# EAGLE design untitled (EAGLE 9.6.2)
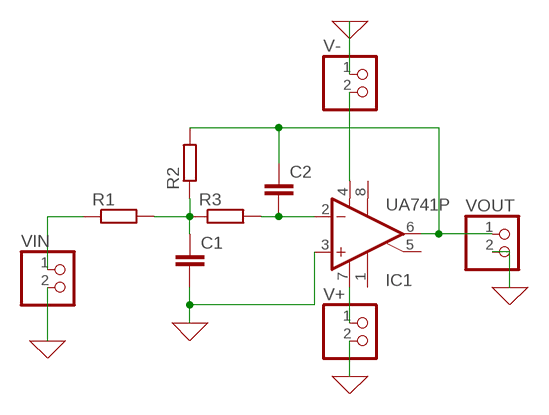
[diagram p0: schematic, sheet 1]

## Parts
C1  C-EU025-025X050  [C025-025X050]
C2  C-EU025-025X050  [C025-025X050]
IC1  UA741P  [DIL08]
R1  R-EU_0411/3V  [0411V]
R2  R-EU_0411/3V  [0411V]
R3  R-EU_0411/3V  [0411V]
V+  PINHD-1X2  [1X02]
V-  PINHD-1X2  [1X02]
VIN  PINHD-1X2  [1X02]
VOUT  PINHD-1X2  [1X02]

## Nets
0: C1.2 IC1.3(+IN) V+.2 V-.1 VIN.2 VOUT.2 ; supply symbol labelled GND
N$1: C1.1 R1.2 R2.1 R3.1
N$2: IC1.7(V+) V+.1
N$3: IC1.4(V-) V-.2
N$4: C2.1 IC1.6(OUT) R2.2 VOUT.1
N$5: C2.2 IC1.2(-IN) R3.2
N$6: R1.1 VIN.1
Unconnected: IC1.1(ON1) IC1.5(ON2) IC1.8(OPT)

## Library data of the parts
C1 C2 = rcl:C-EU: CAPACITOR, European symbol; SPICEPREFIX: C
IC1 = linear:*741: OP AMP
R1-R3 = rcl:R-EU_: RESISTOR, European symbol; SPICEPREFIX: R
V+ V- VIN VOUT = pinhead:PINHD-1X2: PIN HEADER

## Board
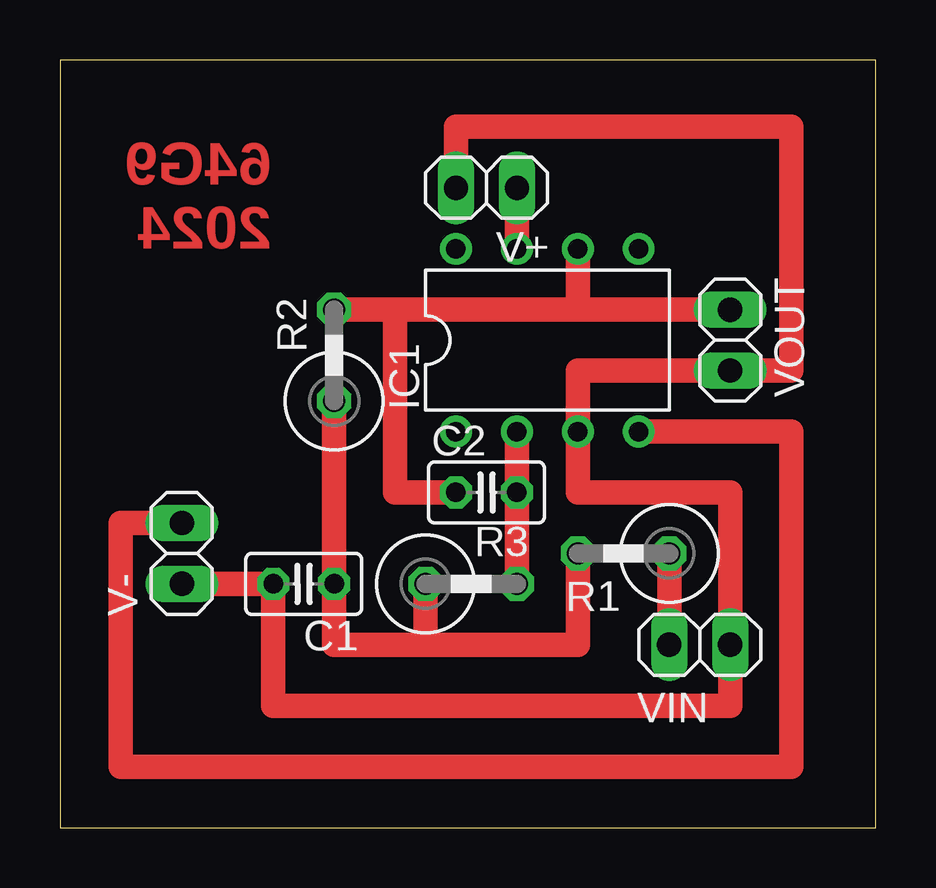
[diagram p1: board, top side]

Size 34 x 32 mm. Coordinates in mm from the lower left corner, seen from the top.
Outline: 0,0 34,0 34,32 0,32 0,0
Copper layers (1*16): Top 0.035mm / dielectric 1.5mm / Bottom 0.035mm
Design rules "default": minimum track width 6mil, minimum drill 0.35mm, track to track 6mil, track to pad 6mil, pad to pad 6mil, via to via 6mil, smd to smd 6mil, copper to edge 40mil, drill to drill 6mil, minimum pad ring 10mil, minimum via ring 8mil, stop-mask expansion 4mil, vias tented up to drill 0mil, thermal gap 10mil

### Footprints (pad centres in the part's own frame; a part is rotated, then mirrored left to right if it is on the bottom)
C025-025X050 = drill 0.813 octagon: 1 -1.27,0; 2 1.27,0
DIL08 = drill 0.813 pad 1.27: 1 -3.81,-3.81; 2 -1.27,-3.81; 3 1.27,-3.81; 4 3.81,-3.81; 5 3.81,3.81; 6 1.27,3.81; 7 -1.27,3.81; 8 -3.81,3.81
0411V = drill 0.914 octagon: 1 -2.54,0; 2 1.27,0
1X02 = drill 1.016 long: 1 -1.27,0; 2 1.27,0

### Placement (x,y rotation side)
C1  10.16,10.16 180 top
C2  17.78,13.97 0 top
IC1  20.32,20.32 0 top
R1  22.86,11.43 180 top
R2  11.43,20.32 90 top
R3  17.78,10.16 0 top
V+  17.78,26.67 180 top
V-  5.08,11.43 90 top
VIN  26.67,7.62 0 top
VOUT  27.94,20.32 270 top

### Tracks (layer width: path | path; a pad name or v marks a point on that pad's centre or on a via)
0
  Top 1.016: V+.2 16.51,29.21 30.48,29.21 30.48,19.05 VOUT.2 21.59,19.05 IC1.3 21.59,13.97 27.94,13.97 VIN.2 27.94,5.08 8.89,5.08 C1.2 V-.1
N$1
  Top 1.016: R3.1 15.24,7.62 | 15.24,7.62 21.59,7.62 R1.2 | 15.24,7.62 11.43,7.62 C1.1 R2.1
N$2
  Top 1.016: V+.1 IC1.7
N$3
  Top 1.016: V-.2 2.54,12.7 2.54,2.54 30.48,2.54 30.48,16.51 IC1.4
N$4
  Top 1.016: IC1.6 21.59,21.59 | VOUT.1 21.59,21.59 | C2.1 13.97,13.97 13.97,21.59 | 13.97,21.59 R2.2 | 21.59,21.59 13.97,21.59
N$5
  Top 1.016: IC1.2 C2.2 R3.2
N$6
  Top 1.016: VIN.1 R1.1

### Text on the board
Top: 64G9 / 2024